# EAGLE schematic TDFC_V2.0_Black_10by10_1.6mm_ENIG_10pcs (EAGLE 6.5.0)
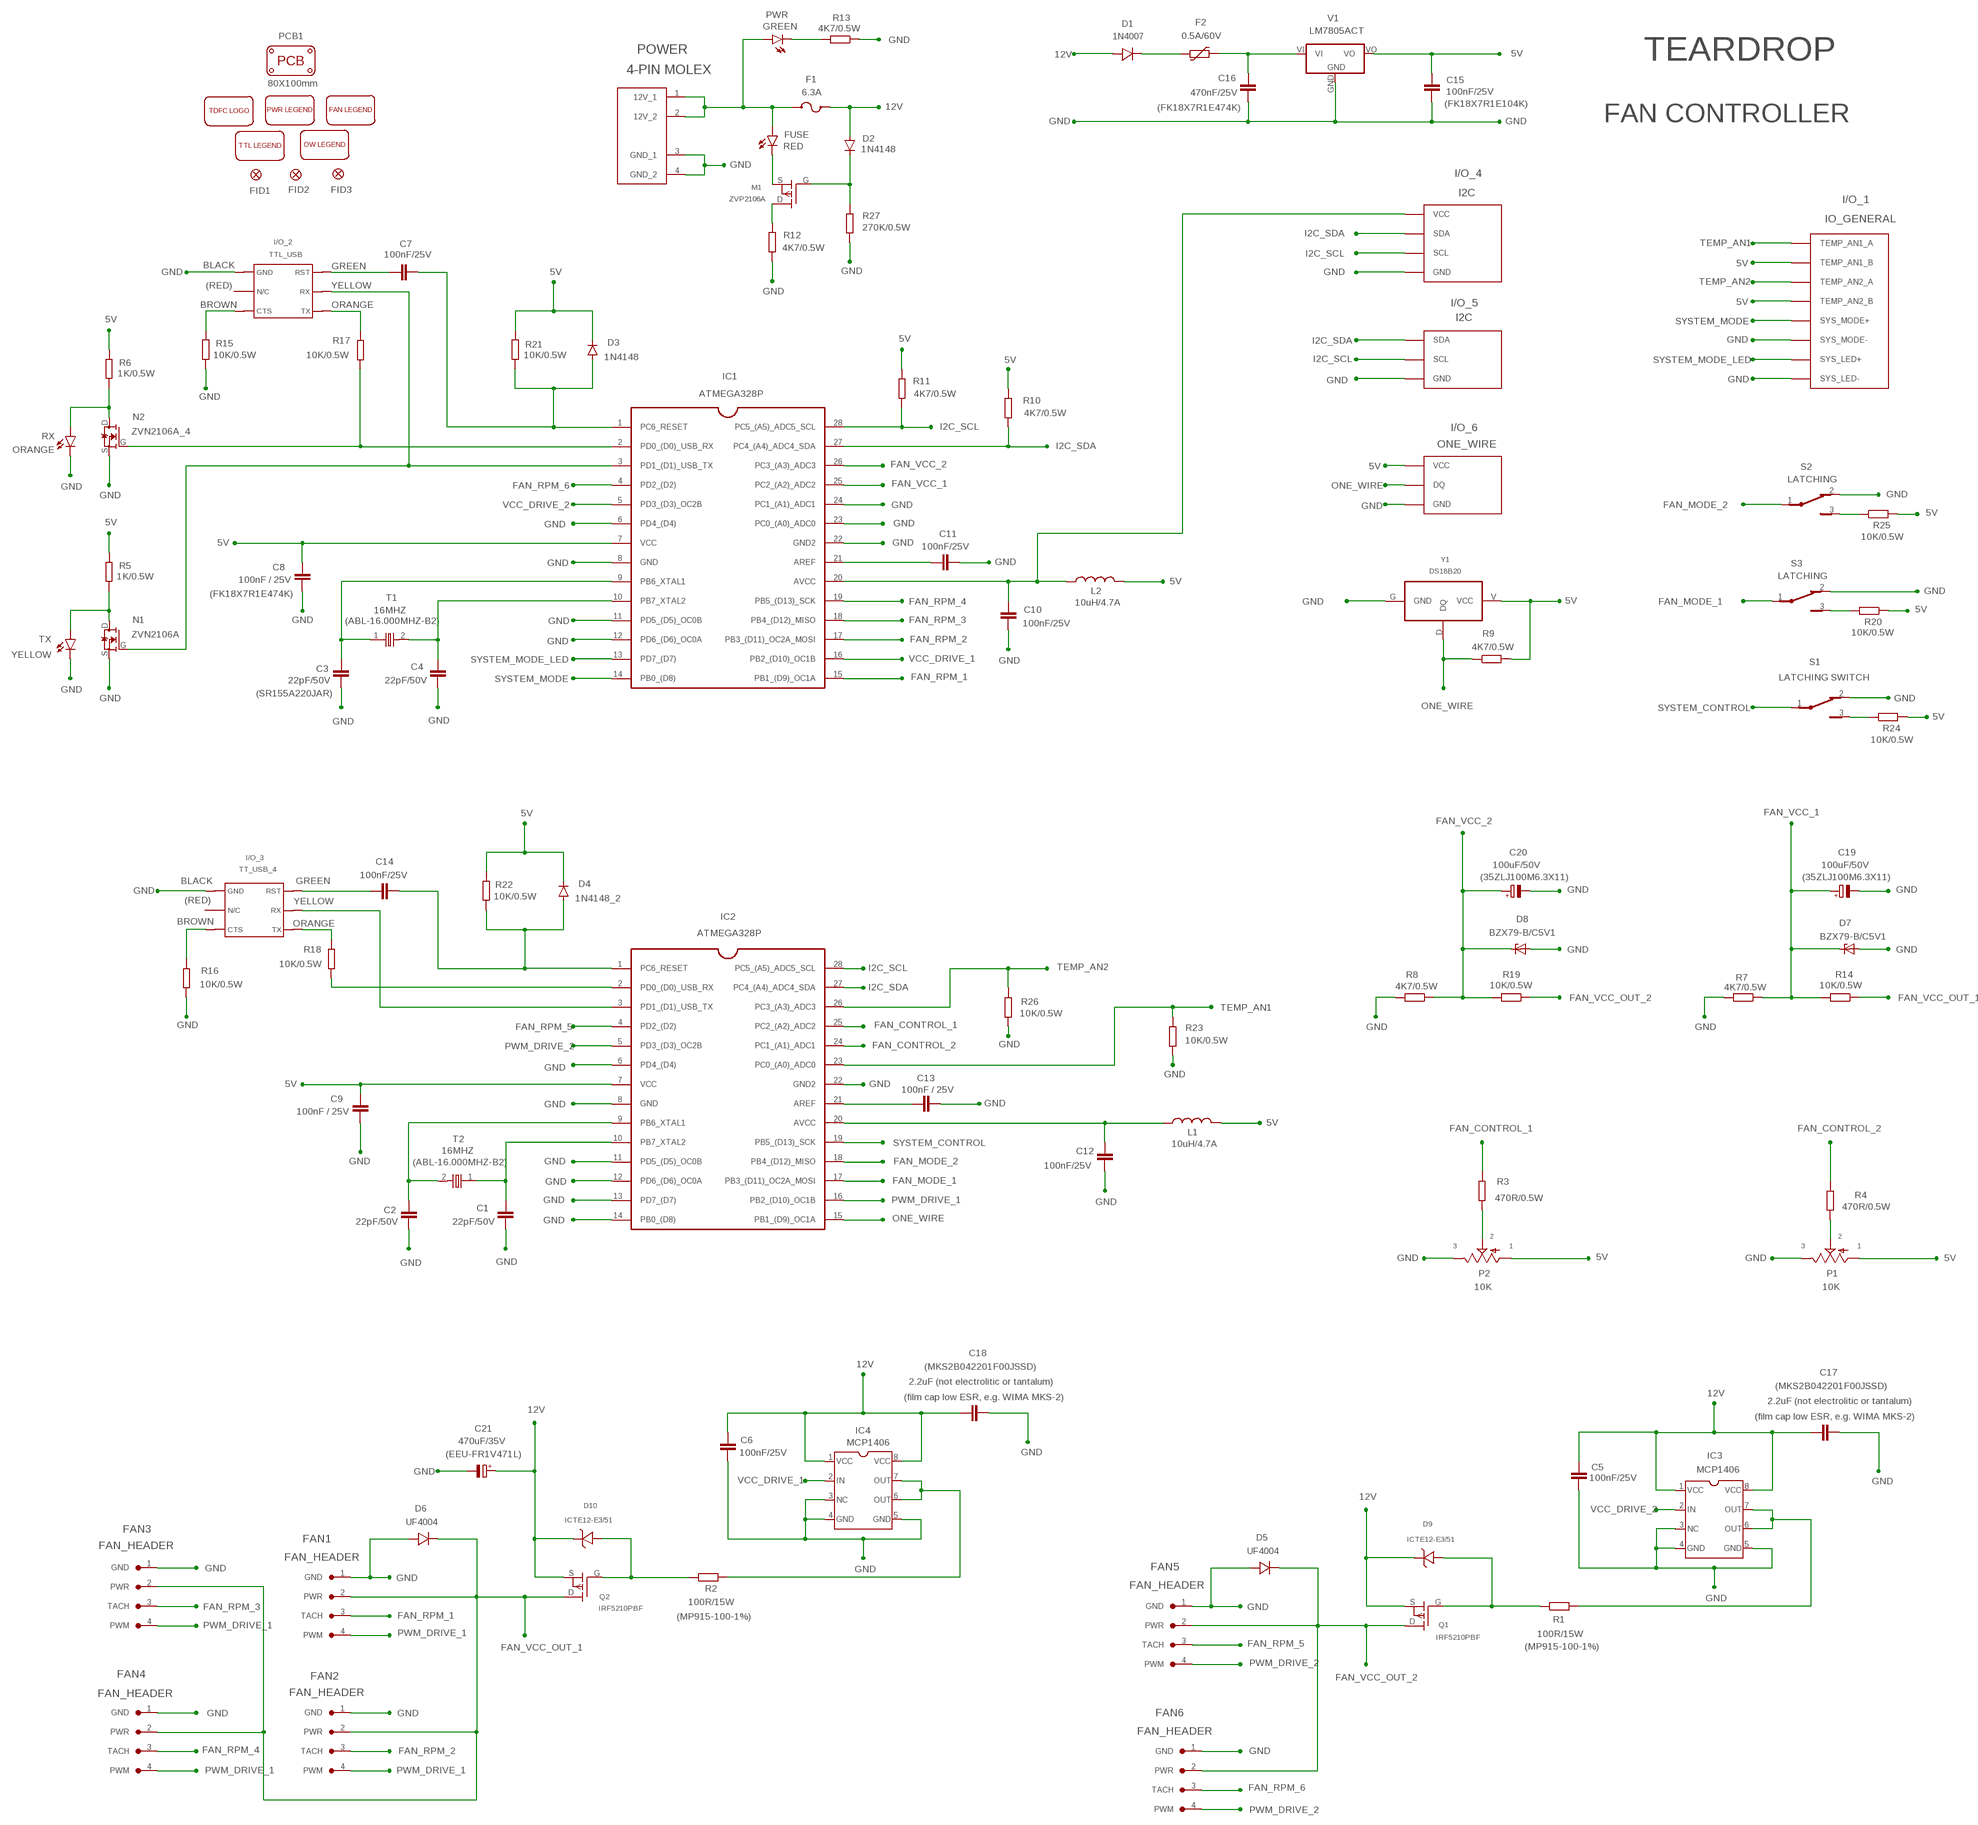
[diagram p0: schematic, sheet 1]

## Parts
C1  22pF/50V  MLCC_CERAMIC_9  [MLCC_CERAMIC_9]
C2  22pF/50V  MLCC_CERAMIC_9  [MLCC_CERAMIC_9]
C3  22pF/50V  MLCC_CERAMIC_11  [MLCC_CERAMIC_11]
C4  22pF/50V  MLCC_CERAMIC_11  [MLCC_CERAMIC_11]
C5  100nF/25V  MLCC_CERAMIC_5  [MLCC_CERAMIC_5]
C6  100nF/25V  MLCC_CERAMIC_5  [MLCC_CERAMIC_5]
C7  100nF/25V  MLCC_CERAMIC_7  [MLCC_CERAMIC_7]
C8  100nF / 25V  MLCC_CERAMIC_5  [MLCC_CERAMIC_5]
C9  100nF / 25V  MLCC_CERAMIC_5  [MLCC_CERAMIC_5]
C10  100nF/25V  MLCC_CERAMIC  [MLCC_CERAMIC]
C11  100nF/25V  MLCC_CERAMIC_17  [MLCC_CERAMIC_17]
C12  100nF/25V  MLCC_CERAMIC_6  [MLCC_CERAMIC_6]
C13  100nF / 25V  MLCC_CERAMIC_6  [MLCC_CERAMIC_6]
C14  100nF/25V  MLCC_CERAMIC_14  [MLCC_CERAMIC_14]
C15  100nF/25V  MLCC_CERAMIC_16  [MLCC_CERAMIC_16]
C16  470nF/25V  MLCC_CERAMIC_15  [MLCC_CERAMIC_15]
C17  (MKS2B042201F00JSSD)  WIMA_CAPACITOR_2  [WIMA_CAPACITOR_2]
C18  (MKS2B042201F00JSSD)  WIMA_CAPACITOR_2  [WIMA_CAPACITOR_2]
C19  100uF/50V  CAPACITOR_6.3_RIGHT  [CAPACITOR_6.3_RIGHT]
C20  100uF/50V  CAPACITOR_6.3_RIGHT  [CAPACITOR_6.3_RIGHT]
C21  470uF/35V  ELECTROLYTIC_CAPACITOR_RIGHT  [ELECTROLYTIC_CAPACITOR_RIGHT]
D1  1N4007  UF4004  [UF4004]
D2  1N4148  [1N4148]
D3  1N4148  [1N4148]
D4  1N4148_2  [1N4148_2]
D5  UF4004  UF4004_2  [UF4004_2]
D6  UF4004  UF4004_2  [UF4004_2]
D7  BZX79-B/C5V1  BZX90_2  [DO34_2]
D8  BZX79-B/C5V1  BZX90  [DO34Z7]
D9  ICTE12-E3/51  TVS_DIODE_5  [TVS_DIODE_5]
D10  ICTE12-E3/51  TVS_DIODE_5  [TVS_DIODE_5]
F1  6.3A  FUSE_GLASS  [FUSE_GLASS]
F2  0.5A/60V  PTC  [PTC]
FAN1  FAN_HEADER  4PIN_FAN_HEADER  [4PIN_FAN_HEADER]
FAN2  FAN_HEADER  4PIN_FAN_HEADER  [4PIN_FAN_HEADER]
FAN3  FAN_HEADER  4PIN_FAN_HEADER  [4PIN_FAN_HEADER]
FAN4  FAN_HEADER  4PIN_FAN_HEADER  [4PIN_FAN_HEADER]
FAN5  FAN_HEADER  4PIN_FAN_HEADER  [4PIN_FAN_HEADER]
FAN6  FAN_HEADER  4PIN_FAN_HEADER  [4PIN_FAN_HEADER]
FID1  FIDUCIAL1X2  [FIDUCIAL-1X2]
FID2  FIDUCIAL1X2  [FIDUCIAL-1X2]
FID3  FIDUCIAL1X2  [FIDUCIAL-1X2]
FUSE  RED  LED_1.8_LEFT  [LED_1.8_LEFT]
I/O_1  IO_GENERAL  IO_GENERAL_7  [IO_GENERAL_7]
I/O_2  TTL_USB  TTL_USB_5  [TTL_USB_5]
I/O_3  TT_USB_4  [TT_USB_4]
I/O_4  I2C  4_PIN_HEADER_VERTICAL_2  [4_PIN_HEADER_VERTICAL_2]
I/O_5  I2C  3_PIN_VERTICAL_4  [3_PIN_VERTICAL_4]
I/O_6  ONE_WIRE  3_PIN_VERTICAL  [3_PIN_VERTICAL]
IC1  ATMEGA328P  [ATMEGA328P]
IC2  ATMEGA328P  ATMEGA328P_VER_2.0  [ATMEGA328P_2]
IC3  MCP1406  TC4420  [TC4420]
IC4  MCP1406  TC4420  [TC4420]
L1  10uH/4.7A  INDUCTOR  [INDUCTOR]
L2  10uH/4.7A  INDUCTOR  [INDUCTOR]
M1  ZVP2106A  [ZVP2106A]
N1  ZVN2106A  [ZVN2106A]
N2  ZVN2106A_4  [ZVN2106A_4]
P1  10K  POTENTIMETER_SQUARE  [POTENTIMETER_SQUARE]
P2  10K  POTENTIMETER_SQUARE  [POTENTIMETER_SQUARE]
PCB1  80X100mm  PCB_DP_RECTANGLE-80X100  [DP10080_V1]
POWER  4-PIN MOLEX  MOLEX_4PIN_2  [MOLEX_4PIN_2]
PWR  GREEN  LED_1.8_LEFT  [LED_1.8_LEFT]
Q1  IRF5210PBF  IRF5210  [IRF5210]
Q2  IRF5210PBF  IRF5210  [IRF5210]
R1  100R/15W  R-EU_V234/12  [V234/12]
R2  100R/15W  R-EU_V234/12  [V234/12]
R3  470R/0.5W  R-EU_0204/5  [0204/5]
R4  470R/0.5W  R-EU_0204/5  [0204/5]
R5  1K/0.5W  R-EU_0204/5  [0204/5]
R6  1K/0.5W  R-EU_0204/5  [0204/5]
R7  4K7/0.5W  R-EU_0204/5  [0204/5]
R8  4K7/0.5W  R-EU_0204/5  [0204/5]
R9  4K7/0.5W  R-EU_0204/5  [0204/5]
R10  4K7/0.5W  R-EU_0204/5  [0204/5]
R11  4K7/0.5W  R-EU_0204/5  [0204/5]
R12  4K7/0.5W  R-EU_0204/5  [0204/5]
R13  4K7/0.5W  R-EU_0204/5  [0204/5]
R14  10K/0.5W  R-EU_0204/5  [0204/5]
R15  10K/0.5W  R-EU_0204/5  [0204/5]
R16  10K/0.5W  R-EU_0204/5  [0204/5]
R17  10K/0.5W  R-EU_0204/5  [0204/5]
R18  10K/0.5W  R-EU_0204/5  [0204/5]
R19  10K/0.5W  R-EU_0204/5  [0204/5]
R20  10K/0.5W  R-EU_0204/5  [0204/5]
R21  10K/0.5W  R-EU_0204/5  [0204/5]
R22  10K/0.5W  R-EU_0204/5  [0204/5]
R23  10K/0.5W  R-EU_0204/5  [0204/5]
R24  10K/0.5W  R-EU_0204/5  [0204/5]
R25  10K/0.5W  R-EU_0204/5  [0204/5]
R26  10K/0.5W  R-EU_0204/5  [0204/5]
R27  270K/0.5W  R-EU_0204/5  [0204/5]
RX  ORANGE  LED_1.8_LEFT_2  [LED_1.8_LEFT_2]
S1  LATCHING SWITCH  SLIDING_SWITCH_4  [SLIDING_SWITCH_4]
S2  LATCHING  SLIDING_SWITCH_5  [SLIDING_SWITCH_5]
S3  LATCHING  SLIDING_SWITCH_5  [SLIDING_SWITCH_5]
T1  16MHZ  CRYSTAL_16MHZ  [CRYSTAL_16MHZ]
T2  16MHZ  CRYSTAL_16MHZ  [CRYSTAL_16MHZ]
TX  YELLOW  LED_1.8_LEFT_2  [LED_1.8_LEFT_2]
U$1  TDFC_LOGO  [TDFC_LOGO]
U$2  MOLEX_4PIN_LEGEND_2  [MOLEX_4PIN_LEGEND_2]
U$3  FAN_HEADER_LEGEND  [FAN_HEADER_LEGEND]
U$4  TTL_USB_6  [TTL_USB_6]
U$5  3_PIN_VERTICAL_LEGEND  [3_PIN_VERTICAL_LEGEND]
V1  LM7805ACT  LM7805  [LM7805]
Y1  DS18B20  [DS18B20]

## Nets
1: C10.1 I/O_4.VCC IC1.20(AVCC) L2.1
5V: C8.1 C9.1 C15.2 D3.C D4.C I/O_1.TEMP_AN1_B I/O_1.TEMP_AN2_B I/O_6.VCC IC1.7(VCC) IC2.7(VCC) L1.2 L2.2 P1.1(A) P2.1(A) R5.2 R6.2 R9.2 R10.1 R11.1 R20.1 R21.2 R22.2 R24.2 R25.2 V1.VO Y1.V(VCC)
12V: C5.2 C6.2 C17.1 C18.1 C21.+ D1.A D2.A D9.C D10.C F1.2 IC3.1 IC3.8 IC4.1 IC4.8 Q1.S Q2.S
FAN_CONTROL_1: IC2.25(PC2_(A2)_ADC2) R3.1
FAN_CONTROL_2: IC2.24(PC1_(A1)_ADC1) R4.1
FAN_MODE_1: IC2.17(PB3_(D11)_OC2A_MOSI) S3.1
FAN_MODE_2: IC2.18(PB4_(D12)_MISO) S2.1
FAN_RPM_1: FAN1.3(TACH) IC1.15(PB1_(D9)_OC1A)
FAN_RPM_2: FAN2.3(TACH) IC1.17(PB3_(D11)_OC2A_MOSI)
FAN_RPM_3: FAN3.3(TACH) IC1.18(PB4_(D12)_MISO)
FAN_RPM_4: FAN4.3(TACH) IC1.19(PB5_(D13)_SCK)
FAN_RPM_5: FAN5.3(TACH) IC2.4(PD2_(D2))
FAN_RPM_6: FAN6.3(TACH) IC1.4(PD2_(D2))
FAN_VCC_1: C19.+ D7.C IC1.25(PC2_(A2)_ADC2) R7.1 R14.2
FAN_VCC_2: C20.+ D8.C IC1.26(PC3_(A3)_ADC3) R8.1 R19.2
FAN_VCC_OUT_1: D6.C FAN1.2(PWR) FAN2.2(PWR) FAN3.2(PWR) FAN4.2(PWR) Q2.D R14.1
FAN_VCC_OUT_2: D5.C FAN5.2(PWR) FAN6.2(PWR) Q1.D R19.1
GND: C1.2 C2.2 C3.2 C4.2 C5.1 C6.1 C8.2 C9.2 C10.2 C11.2 C12.2 C13.2 C15.1 C16.2 C17.2 C18.2 C19.- C20.- C21.- D5.A D6.A D7.A D8.A FAN1.1(GND) FAN2.1(GND) FAN3.1(GND) FAN4.1(GND) FAN5.1(GND) FAN6.1(GND) I/O_1.SYSTEM_LED-(SYS_LED-) I/O_1.SYSTEM_MODE-(SYS_MODE-) I/O_2.GND I/O_3.GND I/O_4.GND I/O_5.GND I/O_6.GND IC1.6(PD4_(D4)) IC1.8(GND) IC1.11(PD5_(D5)_OC0B) IC1.12(PD6_(D6)_OC0A) IC1.22(GND2) IC1.23(PC0_(A0)_ADC0) IC1.24(PC1_(A1)_ADC1) IC2.6(PD4_(D4)) IC2.8(GND) IC2.11(PD5_(D5)_OC0B) IC2.12(PD6_(D6)_OC0A) IC2.13(PD7_(D7)) IC2.14(PB0_(D8)) IC2.22(GND2) IC3.3 IC3.4 IC3.5 IC4.3 IC4.4 IC4.5 N1.S N2.S P1.3(E) P2.3(E) POWER.3(GND_1) POWER.4(GND_2) R7.2 R8.2 R12.1 R13.1 R15.1 R16.2 R23.2 R26.2 R27.2 RX.K(C) S1.2 S2.2 S3.2 TX.K(C) V1.GND Y1.G(GND)
I2C_SCL: I/O_4.SCL I/O_5.SCL IC1.28(PC5_(A5)_ADC5_SCL) IC2.28(PC5_(A5)_ADC5_SCL) R11.2
I2C_SDA: I/O_4.SDA I/O_5.SDA IC1.27(PC4_(A4)_ADC4_SDA) IC2.27(PC4_(A4)_ADC4_SDA) R10.2
N$1: C14.1 I/O_3.RST
N$4: D2.C M1.G R27.1
N$7: C13.1 IC2.21(AREF)
N$8: F1.1 FUSE.A POWER.1(12V_1) POWER.2(12V_2) PWR.A
N$9: PWR.K(C) R13.2
N$10: I/O_3.RX IC2.3(PD1_(D1)_USB_TX)
N$11: IC3.6 IC3.7 R1.2
N$12: D10.A Q2.G R2.1
N$13: IC4.6 IC4.7 R2.2
N$14: FUSE.K(C) M1.S
N$16: I/O_3.TX R18.1
N$17: C11.1 IC1.21(AREF)
N$19: D9.A Q1.G R1.1
N$20: I/O_3.CTS R16.1
N$22: D1.C F2.1
N$23: N1.D R5.1 TX.A
N$24: N2.D R6.1 RX.A
N$25: M1.D R12.2
N$26: R25.1 S2.3
N$28: C12.1 IC2.20(AVCC) L1.1
N$29: R20.2 S3.3
N$32: IC2.2(PD0_(D0)_USB_RX) R18.2
N$33: R24.1 S1.3
N$35: P2.2(S) R3.2
N$36: C4.1 IC1.10(PB7_XTAL2) T1.2
N$37: C14.2 D4.A IC2.1(PC6_RESET) R22.1
N$38: C3.1 IC1.9(PB6_XTAL1) T1.1
N$39: P1.2(S) R4.2
N$40: C2.1 IC2.9(PB6_XTAL1) T2.2
N$41: C1.1 IC2.10(PB7_XTAL2) T2.1
ONE_WIRE: I/O_6.DQ IC2.15(PB1_(D9)_OC1A) R9.1 Y1.D(DQ)
POST_FUSE: C16.1 F2.2 V1.VI
PWM_DRIVE_1: FAN1.4(PWM) FAN2.4(PWM) FAN3.4(PWM) FAN4.4(PWM) IC2.16(PB2_(D10)_OC1B)
PWM_DRIVE_2: FAN5.4(PWM) FAN6.4(PWM) IC2.5(PD3_(D3)_OC2B)
RESET: C7.1 D3.A IC1.1(PC6_RESET) R21.1
SYSTEM_CONTROL: IC2.19(PB5_(D13)_SCK) S1.1
SYSTEM_MODE: I/O_1.SYSTEM_MODE+(SYS_MODE+) IC1.14(PB0_(D8))
SYSTEM_MODE_LED: I/O_1.SYSTEM_LED+(SYS_LED+) IC1.13(PD7_(D7))
TEMP_AN1: I/O_1.TEMP_AN1_A IC2.23(PC0_(A0)_ADC0) R23.1
TEMP_AN2: I/O_1.TEMP_AN2_A IC2.26(PC3_(A3)_ADC3) R26.1
USB_CTS: I/O_2.CTS R15.2
USB_RESET_2: C7.2 I/O_2.RST
USB_RX: IC1.2(PD0_(D0)_USB_RX) N2.G R17.2
USB_RX_2: I/O_2.TX R17.1
USB_TX: I/O_2.RX IC1.3(PD1_(D1)_USB_TX) N1.G
VCC_DRIVE_1: IC1.16(PB2_(D10)_OC1B) IC4.2
VCC_DRIVE_2: IC1.5(PD3_(D3)_OC2B) IC3.2

## Notes on the sheet
- TEARDROP
- (FK18X7R1E104K)
- (FK18X7R1E474K)
- FAN CONTROLLER
- FID1 | FID2 | FID3
- BLACK | GREEN
- (RED) | YELLOW
- BROWN | ORANGE
- (FK18X7R1E474K)
- (ABL-16.000MHZ-B2)
- (SR155A220JAR)
- (35ZLJ100M6.3X11) | (35ZLJ100M6.3X11)
- BLACK | GREEN
- (RED) | YELLOW
- BROWN | ORANGE
- (ABL-16.000MHZ-B2)
- 2.2uF (not electrolitic or tantalum)
- (film cap low ESR, e.g. WIMA MKS-2)
- 2.2uF (not electrolitic or tantalum)
- (film cap low ESR, e.g. WIMA MKS-2)
- (EEU-FR1V471L)
- (MP915-100-1%)
- (MP915-100-1%)

## Library data of the parts
C1 C2 = MLCC_CERAMIC (CAPACITOR):MLCC_CERAMIC_9
C3 C4 = MLCC_CERAMIC (CAPACITOR):MLCC_CERAMIC_11
C5 C6 C8 C9 = MLCC_CERAMIC (CAPACITOR):MLCC_CERAMIC_5
C7 = MLCC_CERAMIC (CAPACITOR):MLCC_CERAMIC_7
C10 = MLCC_CERAMIC (CAPACITOR):MLCC_CERAMIC
C11 = MLCC_CERAMIC (CAPACITOR):MLCC_CERAMIC_17
C12 C13 = MLCC_CERAMIC (CAPACITOR):MLCC_CERAMIC_6
C14 = MLCC_CERAMIC (CAPACITOR):MLCC_CERAMIC_14
C15 = MLCC_CERAMIC (CAPACITOR):MLCC_CERAMIC_16
C16 = MLCC_CERAMIC (CAPACITOR):MLCC_CERAMIC_15
C17 C18 = WIMA_CAPACITOR:WIMA_CAPACITOR_2
C19 C20 = ELECTROLYTIC_CAPACITOR:CAPACITOR_6.3_RIGHT
C21 = ELECTROLYTIC_CAPACITOR:ELECTROLYTIC_CAPACITOR_RIGHT
D1 = UF4004:UF4004
D2 D3 = 1N4148:1N4148
D4 = 1N4148:1N4148_2
D5 D6 = UF4004:UF4004_2
D7 = ZENER DIODE (BZX79) - VER. 5.0:BZX90_2
D8 = ZENER DIODE (BZX79) - VER. 5.0:BZX90: Z DIODE
D9 D10 = TVS DIODE ((ICTE12-E3-51):TVS_DIODE_5
F1 = FUSE (GLASS):FUSE_GLASS
F2 = PTC:PTC
FAN1-FAN6 = FAN_HEADER (4-PIN):4PIN_FAN_HEADER
FID1-FID3 = SparkFun-Aesthetics:FIDUCIAL: Fiducial Alignment Points Various fiducial points for machine vision alignment.
FUSE PWR = LED_1.8:LED_1.8_LEFT
I/O_1 = IO_4-PIN:IO_GENERAL_7
I/O_2 = TTL_USB:TTL_USB_5
I/O_3 = TTL_USB:TT_USB_4
I/O_4 = HEADER:4_PIN_HEADER_VERTICAL_2
I/O_5 = HEADER:3_PIN_VERTICAL_4
I/O_6 = HEADER:3_PIN_VERTICAL
IC1 = ATMEGA328P_VER_2.0:ATMEGA328P
IC2 = ATMEGA328P_VER_2.0:ATMEGA328P_VER_2.0
IC3 IC4 = TC4420:TC4420
L1 L2 = INDUCTOR:INDUCTOR
M1 = ZVP2106A:ZVP2106A
N1 = ZVN2106A:ZVN2106A
N2 = ZVN2106A:ZVN2106A_4
P1 P2 = POTENTIMETER_SQUARE:POTENTIMETER_SQUARE
PCB1 = PCB_TEMPLATES - VER. 4.0:PCB_DP_RECTANGLE: Dangerous Prototypes Standard Rectangular PCB sizes; PCB_SIZE: DP10080_V1
POWER = POWER HEADER (MOLEX_4 PIN):MOLEX_4PIN_2
Q1 Q2 = MOSFET (IRF5210PBF):IRF5210
R1 R2 = RESISTOR (100R, 15W, TO-126):R-EU_: RESISTOR, European symbol
R3-R27 = RESISTOR (REGULAR, 0.25W):R-EU_: RESISTOR, European symbol
RX TX = LED_1.8:LED_1.8_LEFT_2
S1 = SLIDING_SWITCH:SLIDING_SWITCH_4
S2 S3 = SLIDING_SWITCH:SLIDING_SWITCH_5
T1 T2 = CRYSTAL_16MHZ:CRYSTAL_16MHZ
U$1 = TDPC_LOGO:TDFC_LOGO
U$2 = POWER HEADER (MOLEX_4 PIN):MOLEX_4PIN_LEGEND_2
U$3 = POWER HEADER (MOLEX_4 PIN):FAN_HEADER_LEGEND
U$4 = TTL_USB:TTL_USB_6
U$5 = HEADER:3_PIN_VERTICAL_LEGEND
V1 = LM7805:LM7805
Y1 = DS18B20:DS18B20

## Net classes
0 default: clearance 0.355 mm